# Altium schematic sheet SCB_PLLs.SchDoc: SCB_PLLs
size A3; Date: 18/06/2014; DrawnBy: J. Gabriel R.E.; Organization: Seven Solutions S.L.; Address1: C/Baza, Parcela 19, Nave 3; Address2: Polígono Ind. Juncaril; Address3: 18210-Peligros-Granada; Address4: Spain; Revision: 3.4; SheetNumber: 17; SheetTotal: 23; WebAddress: www.sevensols.com; Project: White Rabbit; ProjectName: Project Name
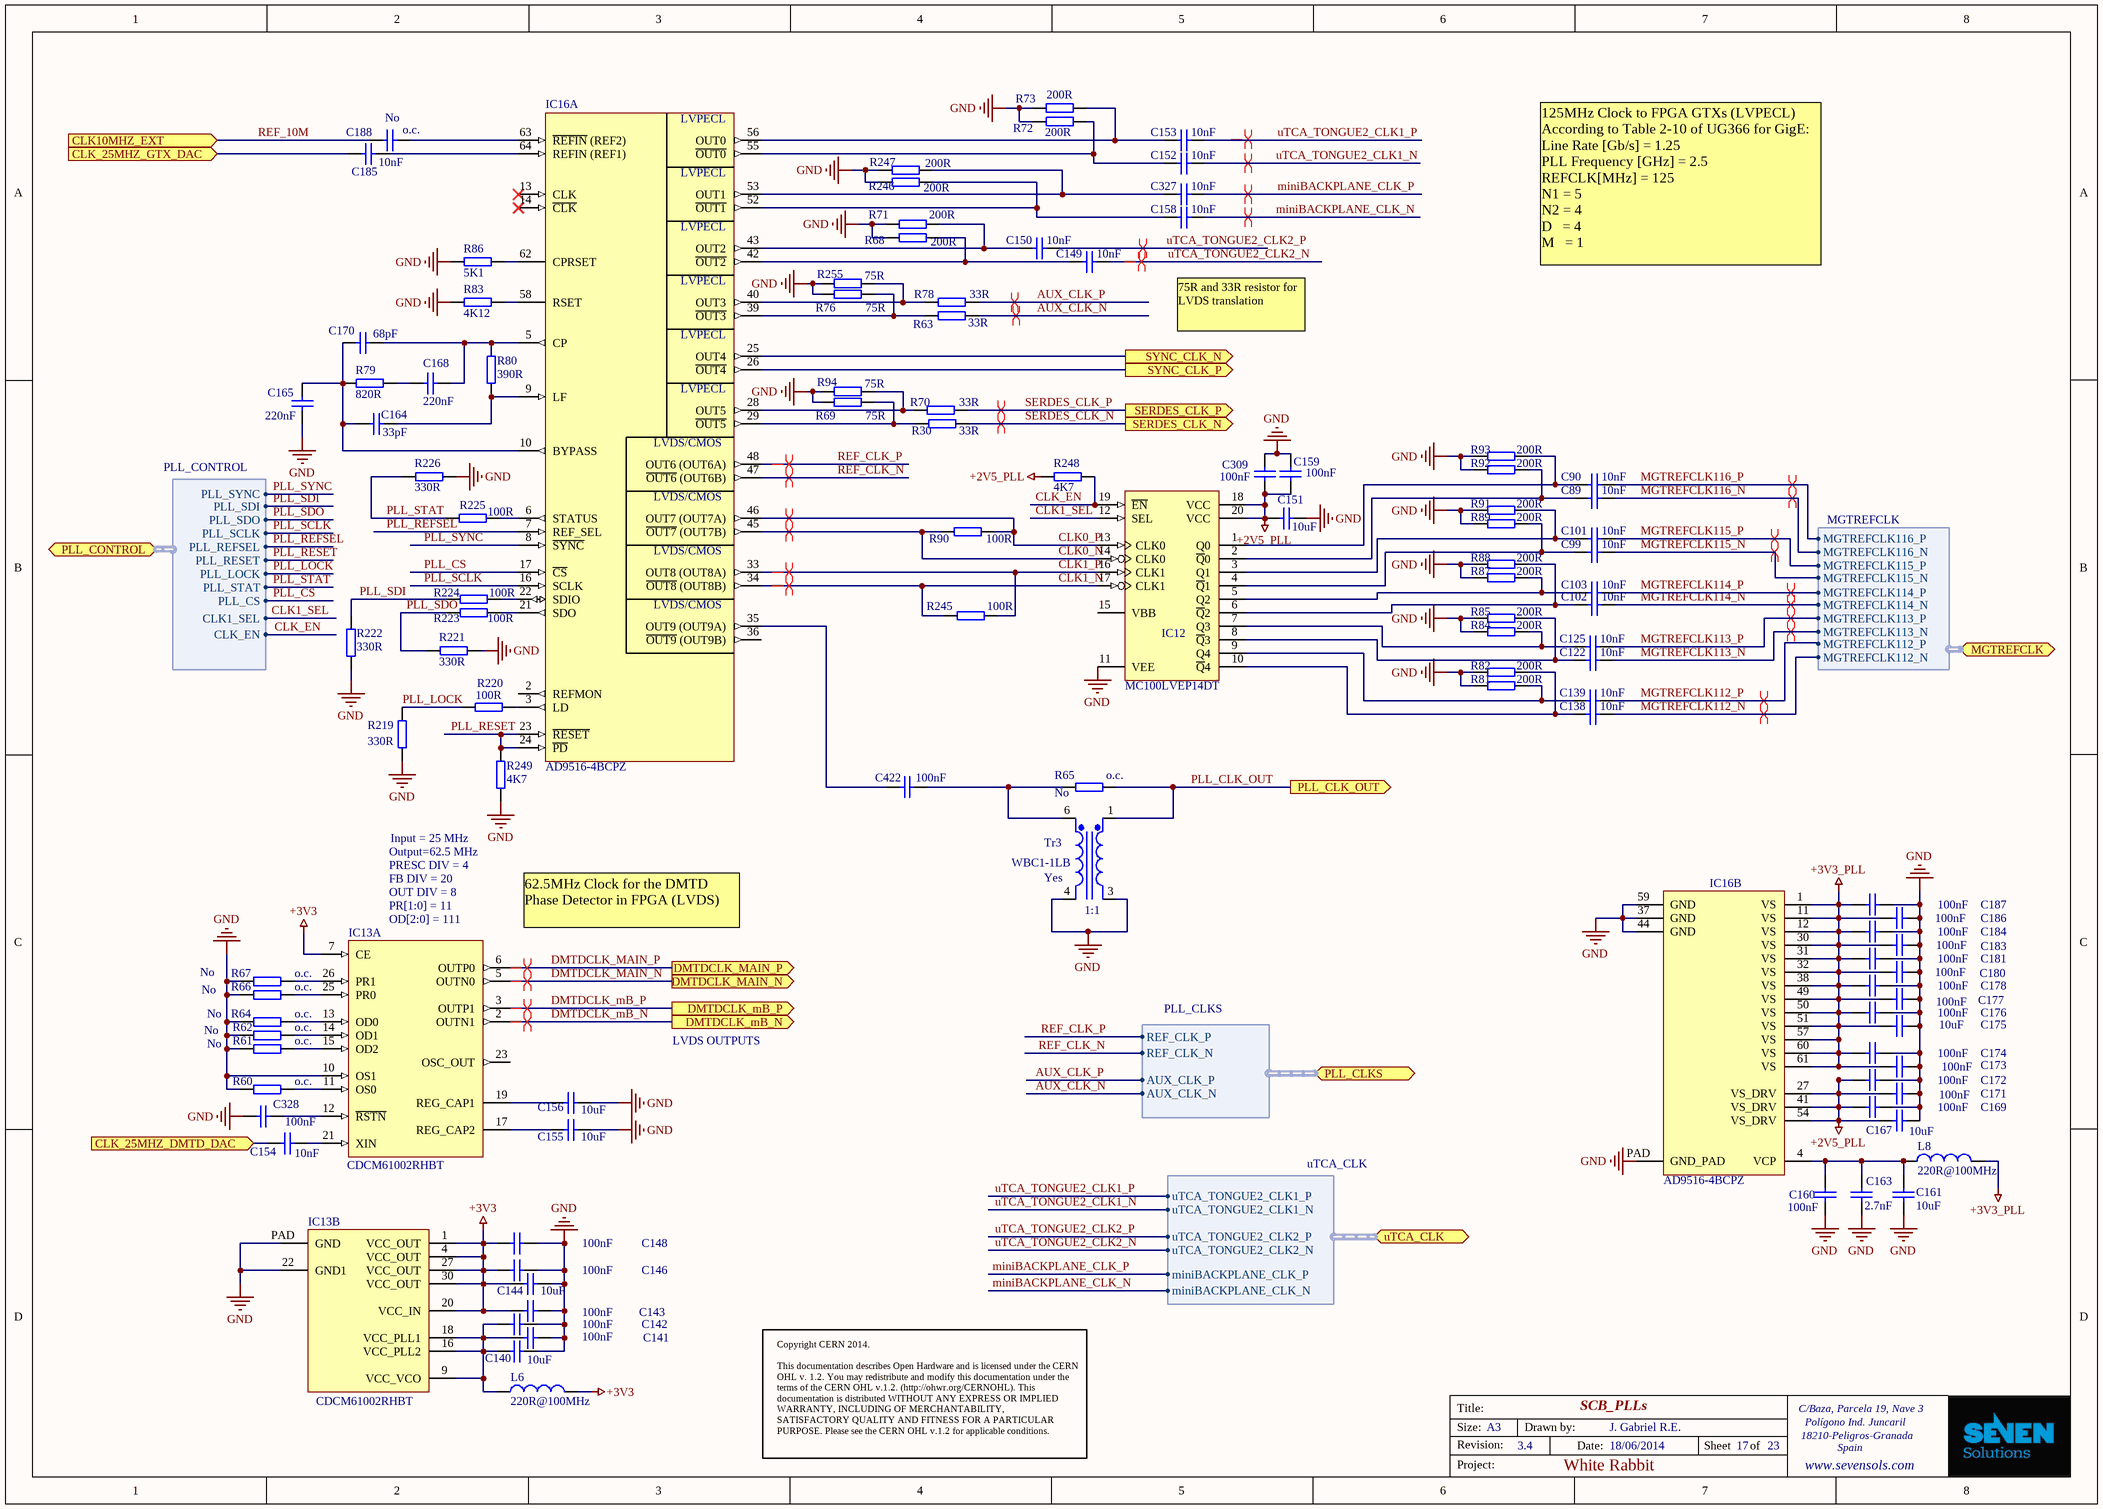
[diagram p0: SCB_PLLs.SchDoc]

## Parts
C89  10nF  [CC1005-0402]
C90  10nF  [CC1005-0402]
C99  10nF  [CC1005-0402]
C101  10nF  [CC1005-0402]
C102  10nF  [CC1005-0402]
C103  10nF  [CC1005-0402]
C122  10nF  [CC1005-0402]
C125  10nF  [CC1005-0402]
C138  10nF  [CC1005-0402]
C139  10nF  [CC1005-0402]
C140  10uF  [CC1608-0603]
C141  100nF  [CC1005-0402]
C142  100nF  [CC1005-0402]
C143  100nF  [CC1005-0402]
C144  10uF  [CC1608-0603]
C146  100nF  [CC1005-0402]
C148  100nF  [CC1005-0402]
C149  10nF  [CC1005-0402]
C150  10nF  [CC1005-0402]
C151  10uF  [CC1608-0603]
C152  10nF  [CC1005-0402]
C153  10nF  [CC1005-0402]
C154  10nF  [CC1005-0402]
C155  10uF  [CC1608-0603]
C156  10uF  [CC1608-0603]
C158  10nF  [CC1005-0402]
C159  100nF  [CC1005-0402]
C160  100nF  [CC1005-0402]
C161  10uF  [CC1608-0603]
C163  2.7nF  [CC1005-0402]
C164  33pF  [CC1608-0603]
C165  220nF  [CC1608-0603]
C167  10uF  [CC1608-0603]
C168  220nF  [CC1608-0603]
C169  100nF  [CC1005-0402]
C170  68pF  [CC1608-0603]
C171  100nF  [CC1005-0402]
C172  100nF  [CC1005-0402]
C173  100nF  [CC1005-0402]
C174  100nF  [CC1005-0402]
C175  10uF  [CC1608-0603]
C176  100nF  [CC1005-0402]
C177  100nF  [CC1005-0402]
C178  100nF  [CC1005-0402]
C180  100nF  [CC1005-0402]
C181  100nF  [CC1005-0402]
C183  100nF  [CC1005-0402]
C184  100nF  [CC1005-0402]
C185  10nF  [CC1005-0402]
C186  100nF  [CC1005-0402]
C187  100nF  [CC1005-0402]
C188  o.c.  Mounted: No  [CC1005-0402]
C309  100nF  [CC1005-0402]
C327  10nF  [CC1005-0402]
C328  100nF  [CC1005-0402]
C422  100nF  [CC1005-0402]
IC12  MC100LVEP14DT  [948E-02_N]
IC13  CDCM61002RHBT  [QFN32_POWERPAD]  (parts A,B of 2)
IC16  AD9516-4BCPZ  [QFN50P900X900X100-64M]  (parts A,B of 2)
L6  Impedance: 220R@100MHz  [0603]  (hidden comment: 220R@100MHz Ferrite Bead)
L8  Impedance: 220R@100MHz  [0603]  (hidden comment: 220R@100MHz Ferrite Bead)
R30  33R  [0402]
R60  o.c.  [0402]
R61  Mounted: No  [0402]  (hidden comment: o.c.)
R62  Mounted: No  [0402]  (hidden comment: o.c.)
R63  33R  [0402]
R64  Mounted: No  [0402]  (hidden comment: o.c.)
R65  Mounted: No  [0402]  (hidden comment: o.c.)
R66  Mounted: No  [0402]  (hidden comment: o.c.)
R67  Mounted: No  [0402]  (hidden comment: o.c.)
R68  200R  [0402]
R69  75R  [0402]
R70  33R  [0402]
R71  200R  [0402]
R72  200R  [0402]
R73  200R  [0402]
R76  75R  [0402]
R78  33R  [0402]
R79  820R  [0603]
R80  390R  [0603]
R81  200R  [0402]
R82  200R  [0402]
R83  4K12  [0402]
R84  200R  [0402]
R85  200R  [0402]
R86  5K1  [0402]
R87  200R  [0402]
R88  200R  [0402]
R89  200R  [0402]
R90  100R  [0402]
R91  200R  [0402]
R92  200R  [0402]
R93  200R  [0402]
R94  75R  [0402]
R219  330R  [0402]
R220  100R  [0402]
R221  330R  [0402]
R222  330R  [0402]
R223  100R  [0402]
R224  100R  [0402]
R225  100R  [0402]
R226  330R  [0402]
R245  100R  [0402]
R246  200R  [0402]
R247  200R  [0402]
R248  4K7  [0402]
R249  4K7  [0402]
R255  75R  [0402]
Tr3  WBC1-1LB  value 1:1  Mounted: Yes  [SMT6P150P]

## Ports
CLK10MHZ_EXT (in), CLK_25MHZ_DMTD_DAC (in), CLK_25MHZ_GTX_DAC (in), DMTDCLK_MAIN_N (out), DMTDCLK_MAIN_P (out), DMTDCLK_mB_N (out), DMTDCLK_mB_P (out), MGTREFCLK (harness MGTREFCLK), PLL_CLK_OUT (out), PLL_CLKS (harness PLL_CLKS), PLL_CONTROL (harness PLL_CONTROL), SERDES_CLK_N (out), SERDES_CLK_P (out), SYNC_CLK_N (out), SYNC_CLK_P (out), uTCA_CLK (harness uTCA_CLK)

## Harnesses
PLL_CONTROL: PLL_CS, PLL_STAT, PLL_LOCK, PLL_RESET, PLL_REFSEL, PLL_SCLK, PLL_SDO, PLL_SDI, PLL_SYNC, CLK1_SEL, CLK_EN
PLL_CLKS: REF_CLK_P, REF_CLK_N, AUX_CLK_P, AUX_CLK_N
MGTREFCLK: MGTREFCLK112_P, MGTREFCLK112_N, MGTREFCLK113_P, MGTREFCLK113_N, MGTREFCLK114_P, MGTREFCLK114_N, MGTREFCLK115_P, MGTREFCLK115_N, MGTREFCLK116_P, MGTREFCLK116_N
uTCA_CLK: uTCA_TONGUE2_CLK1_P, uTCA_TONGUE2_CLK1_N, uTCA_TONGUE2_CLK2_P, uTCA_TONGUE2_CLK2_N, miniBACKPLANE_CLK_P, miniBACKPLANE_CLK_N

## Nets
+2V5_PLL: C151.2 C159.2 C167.1 C169.2 C171.2 C172.2 C309.2 IC12.18(VCC) IC12.20(VCC) IC16.27(VS_DRV) IC16.41(VS_DRV) IC16.54(VS_DRV) R248.2
+3V3: C143.2 C144.1 C146.2 C148.2 IC13.1(VCC_OUT) IC13.4(VCC_OUT) IC13.7(CE) IC13.20(VCC_IN) IC13.27(VCC_OUT) IC13.30(VCC_OUT) L6.2
+3V3_PLL: C173.2 C174.2 C175.1 C176.2 C177.2 C178.2 C180.2 C181.2 C183.2 C184.2 C186.2 C187.2 IC16.1(VS) IC16.11(VS) IC16.12(VS) IC16.30(VS) IC16.31(VS) IC16.32(VS) IC16.38(VS) IC16.49(VS) IC16.50(VS) IC16.51(VS) IC16.57(VS) IC16.60(VS) IC16.61(VS) L8.2
GND: C140.2 C141.1 C142.1 C143.1 C144.2 C146.1 C148.1 C151.1 C155.2 C156.2 C159.1 C160.2 C161.1 C163.1 C165.1 C167.2 C169.1 C171.1 C172.1 C173.1 C174.1 C175.2 C176.1 C177.1 C178.1 C180.1 C181.1 C183.1 C184.1 C186.1 C187.1 C309.1 C328.2 IC12.11(VEE) IC13.10(OS1) IC13.22(GND1) IC13.PAD(GND) IC16.37(GND) IC16.44(GND) IC16.59(GND) IC16.PAD(GND_PAD) R60.2 R61.2 R62.2 R64.2 R66.2 R67.2 R68.2 R69.1 R71.2 R72.2 R73.2 R76.1 R81.2 R82.2 R83.1 R84.2 R85.2 R86.1 R87.2 R88.2 R89.2 R91.2 R92.2 R93.2 R94.1 R219.1 R221.1 R222.1 R226.1 R246.2 R247.2 R249.1 R255.1 Tr3.3(Sec-) Tr3.4(Pri-)
AUX_CLK_N: R63.2 ; port PLL_CLKS.AUX_CLK_N
AUX_CLK_P: R78.2 ; port PLL_CLKS.AUX_CLK_P
CLK0_N: IC12.14(CLK0) IC16.45(~{OUT7}_(OUT7B)) R90.1
CLK0_P: IC12.13(CLK0) IC16.46(OUT7_(OUT7A)) R90.2
CLK1_N: IC12.17(CLK1) IC16.34(~{OUT8}_(OUT8B)) R245.1
CLK1_P: IC12.16(CLK1) IC16.33(OUT8_(OUT8A)) R245.2
CLK1_SEL: IC12.12(SEL) ; port PLL_CONTROL.CLK1_SEL
CLK_25MHZ_DMTD_DAC: C154.2 ; port CLK_25MHZ_DMTD_DAC
CLK_25MHZ_GTX_DAC: C185.1 ; port CLK_25MHZ_GTX_DAC
CLK_EN: IC12.19(~{EN}) R248.1 ; port PLL_CONTROL.CLK_EN
DMTDCLK_MAIN_N: IC13.5(OUTN0) ; port DMTDCLK_MAIN_N
DMTDCLK_MAIN_P: IC13.6(OUTP0) ; port DMTDCLK_MAIN_P
DMTDCLK_mB_N: IC13.2(OUTN1) ; port DMTDCLK_mB_N
DMTDCLK_mB_P: IC13.3(OUTP1) ; port DMTDCLK_mB_P
MGTREFCLK112_N: C138.1 ; port MGTREFCLK.MGTREFCLK112_N
MGTREFCLK112_P: C139.1 ; port MGTREFCLK.MGTREFCLK112_P
MGTREFCLK113_N: C122.1 ; port MGTREFCLK.MGTREFCLK113_N
MGTREFCLK113_P: C125.1 ; port MGTREFCLK.MGTREFCLK113_P
MGTREFCLK114_N: C102.1 ; port MGTREFCLK.MGTREFCLK114_N
MGTREFCLK114_P: C103.1 ; port MGTREFCLK.MGTREFCLK114_P
MGTREFCLK115_N: C99.1 ; port MGTREFCLK.MGTREFCLK115_N
MGTREFCLK115_P: C101.1 ; port MGTREFCLK.MGTREFCLK115_P
MGTREFCLK116_N: C89.1 ; port MGTREFCLK.MGTREFCLK116_N
MGTREFCLK116_P: C90.1 ; port MGTREFCLK.MGTREFCLK116_P
miniBACKPLANE_CLK_N: C158.1 ; port uTCA_CLK.miniBACKPLANE_CLK_N
miniBACKPLANE_CLK_P: C327.1 ; port uTCA_CLK.miniBACKPLANE_CLK_P
PLL_CLK_OUT: R65.1 Tr3.1(Sec+) ; port PLL_CLK_OUT
PLL_CS: IC16.17(~{CS}) ; port PLL_CONTROL.PLL_CS
PLL_LOCK: R219.2 R220.2 ; port PLL_CONTROL.PLL_LOCK
PLL_REFSEL: IC16.7(REF_SEL) ; port PLL_CONTROL.PLL_REFSEL
PLL_RESET: IC16.23(~{RESET}) IC16.24(~{PD}) R249.2 ; port PLL_CONTROL.PLL_RESET
PLL_SCLK: IC16.16(SCLK) ; port PLL_CONTROL.PLL_SCLK
PLL_SDI: R222.2 R224.2 ; port PLL_CONTROL.PLL_SDI
PLL_SDO: R221.2 R223.2 ; port PLL_CONTROL.PLL_SDO
PLL_STAT: R225.2 R226.2 ; port PLL_CONTROL.PLL_STAT
PLL_SYNC: IC16.8(~{SYNC}) ; port PLL_CONTROL.PLL_SYNC
REF_10M: C188.1 ; port CLK10MHZ_EXT
REF_CLK_N: IC16.47(~{OUT6}_(OUT6B)) ; port PLL_CLKS.REF_CLK_N
REF_CLK_P: IC16.48(OUT6_(OUT6A)) ; port PLL_CLKS.REF_CLK_P
SERDES_CLK_N: R30.2 ; port SERDES_CLK_N
SERDES_CLK_P: R70.2 ; port SERDES_CLK_P
SYNC_CLK_N: IC16.25(OUT4) ; port SYNC_CLK_N
SYNC_CLK_P: IC16.26(~{OUT4}) ; port SYNC_CLK_P
uTCA_TONGUE2_CLK1_N: C152.1 ; port uTCA_CLK.uTCA_TONGUE2_CLK1_N
uTCA_TONGUE2_CLK1_P: C153.1 ; port uTCA_CLK.uTCA_TONGUE2_CLK1_P
uTCA_TONGUE2_CLK2_N: C149.1 ; port uTCA_CLK.uTCA_TONGUE2_CLK2_N
uTCA_TONGUE2_CLK2_P: C150.1 ; port uTCA_CLK.uTCA_TONGUE2_CLK2_P
NetC89_2: C89.2 IC12.2(~{Q}0) R92.1
NetC90_2: C90.2 IC12.1(Q0) R93.1
NetC99_2: C99.2 IC12.4(~{Q}1) R89.1
NetC101_2: C101.2 IC12.3(Q1) R91.1
NetC102_2: C102.2 IC12.6(~{Q}2) R88.1
NetC103_2: C103.2 IC12.5(Q2) R87.1
NetC122_2: C122.2 IC12.8(~{Q}3) R85.1
NetC125_2: C125.2 IC12.7(Q3) R84.1
NetC138_2: C138.2 IC12.10(~{Q}4) R82.1
NetC139_2: C139.2 IC12.9(Q4) R81.1
NetC140_1: C140.1 C141.2 C142.2 IC13.9(VCC_VCO) IC13.16(VCC_PLL2) IC13.18(VCC_PLL1) L6.1
NetC149_2: C149.2 IC16.42(~{OUT2}) R68.1
NetC150_2: C150.2 IC16.43(OUT2) R71.1
NetC152_2: C152.2 IC16.55(~{OUT0}) R72.1
NetC153_2: C153.2 IC16.56(OUT0) R73.1
NetC154_1: C154.1 IC13.21(XIN)
NetC155_1: C155.1 IC13.17(REG_CAP2)
NetC156_1: C156.1 IC13.19(REG_CAP1)
NetC158_2: C158.2 IC16.52(~{OUT1}) R246.1
NetC160_1: C160.1 C161.2 C163.2 IC16.4(VCP) L8.1
NetC164_1: C164.1 C165.2 C170.1 IC16.10(BYPASS) R79.1
NetC164_2: C164.2 IC16.9(LF) R80.1
NetC168_1: C168.1 R79.2
NetC168_2: C168.2 C170.2 IC16.5(CP) R80.2
NetC185_2: C185.2 IC16.64(REFIN_(REF1))
NetC188_2: C188.2 IC16.63(~{REFIN}_(REF2))
NetC327_2: C327.2 IC16.53(OUT1) R247.1
NetC328_1: C328.1 IC13.12(~{RSTN})
NetC422_1: C422.1 IC16.35(OUT9_(OUT9A))
NetC422_2: C422.2 R65.2 Tr3.6(Pri+)
NetIC13_11: IC13.11(OS0) R60.1
NetIC13_13: IC13.13(OD0) R64.1
NetIC13_14: IC13.14(OD1) R62.1
NetIC13_15: IC13.15(OD2) R61.1
NetIC13_25: IC13.25(PR0) R66.1
NetIC13_26: IC13.26(PR1) R67.1
NetIC16_3: IC16.3(LD) R220.1
NetIC16_6: IC16.6(STATUS) R225.1
NetIC16_21: IC16.21(SDO) R223.1
NetIC16_22: IC16.22(SDIO) R224.1
NetIC16_28: IC16.28(OUT5) R70.1 R94.2
NetIC16_29: IC16.29(~{OUT5}) R30.1 R69.2
NetIC16_39: IC16.39(~{OUT3}) R63.1 R76.2
NetIC16_40: IC16.40(OUT3) R78.1 R255.2
NetIC16_58: IC16.58(RSET) R83.2
NetIC16_62: IC16.62(CPRSET) R86.2

Not connected (* = marked no-connect by the designer): IC12 15(VBB); IC13 23(OSC_OUT); IC16 2(REFMON) 13(CLK)* 14(~{CLK})* 36(~{OUT9}_(OUT9B))

## Layout directives
differential pair: (no net found under the mark), AUX_CLK_N, AUX_CLK_P, CLK0_N, CLK0_P, CLK1_N, CLK1_P, DMTDCLK_MAIN_N, DMTDCLK_MAIN_P, DMTDCLK_mB_N, DMTDCLK_mB_P, MGTREFCLK112_N, MGTREFCLK112_P, MGTREFCLK113_N, MGTREFCLK113_P, MGTREFCLK114_N, MGTREFCLK114_P, MGTREFCLK115_N, MGTREFCLK115_P, MGTREFCLK116_N, MGTREFCLK116_P, miniBACKPLANE_CLK_N, miniBACKPLANE_CLK_P, REF_CLK_N, REF_CLK_P, SERDES_CLK_N, SERDES_CLK_P, uTCA_TONGUE2_CLK1_N, uTCA_TONGUE2_CLK2_N, uTCA_TONGUE2_CLK2_P

## Notes on the sheet
- 125MHz Clock to FPGA GTXs (LVPECL)
  According to Table 2-10 of UG366 for GigE:
  Line Rate [Gb/s] = 1.25
  PLL Frequency [GHz] = 2.5
  REFCLK[MHz] = 125
  N1 = 5
  N2 = 4
  D   = 4
  M   = 1
- 75R and 33R resistor for LVDS translation
- Output=62.5 MHz
- (near R249) Input = 25 MHz
- PRESC DIV = 4
- FB DIV = 20
- OUT DIV = 8
- (near IC13) PR[1:0] = 11
- (near IC13) OD[2:0] = 111
- (near IC13) 62.5MHz Clock for the DMTD Phase Detector in FPGA (LVDS)
- LVDS OUTPUTS
- Copyright CERN 2014.
  This documentation describes Open Hardware and is licensed under the CERN OHL v. 1.2. You may redistribute and modify this documentation under the terms of the CERN OHL v.1.2. (http://ohwr.org/CERNOHL). This documentation is distributed WITHOUT ANY EXPRESS OR IMPLIED WARRANTY, INCLUDING OF MERCHANTABILITY, SATISFACTORY QUALITY AND FITNESS FOR A PARTICULAR PURPOSE. Please see the CERN OHL v.1.2 for applicable conditions.
- Title:
- Size:
- Revision:
- A3
- Drawn by:
- Date:
- Sheet
- of
- Project:
- (in symbol AD9516, part A) LVPECL; LVDS/CMOS

## Library data of the parts
C89 C90 C99 C101-C103 C122 C125 C138 C139 C149 C150 C152-C154 C158 C185 C327 = CC0402_10NF_25V_10%_X7R: Capacitor; Manufacturer1: TDK; Manufacturer1 PN: C1005X7R1E103K; TC: X7R; Tolerance: ±10%; Voltage: 25V; Published: 8-Jun-2000; LatestRevisionDate: 17-Jul-2002; LatestRevisionNote: Re-released for DXP Platform.; PackageReference: RAD-0.3; Publisher: Altium Limited; Distributor1: Digikey; Distributor1 PN: 445-1260-1-ND; Case: 0402; Value: 10nF
C140 C144 C151 C155 C156 C161 C167 C175 = CC0603_10UF_6.3V_20%_X5R: Capacitor; Manufacturer1: TDK; Manufacturer1 PN: C1608X5R0J106M; TC: X5R; Tolerance: ±20%; Voltage: 6.3V; Published: 8-Jun-2000; LatestRevisionDate: 17-Jul-2002; LatestRevisionNote: Re-released for DXP Platform.; PackageReference: RAD-0.3; Publisher: Altium Limited; Distributor1: Digikey; Distributor1 PN: 445-4112-1-ND; Case: 0603; Value: 10uF
C141-C143 C146 C148 C159 C160 C169 C171-C174 C176-C178 C180 C181 C183 C184 C186 C187 C309 C328 C422 = CC0402_100NF_16V_10%_X7R: Capacitor; Manufacturer1: TDK; Manufacturer1 PN: C1005X7R1C104K; TC: X7R; Tolerance: ±10%; Voltage: 16V; Published: 8-Jun-2000; LatestRevisionDate: 17-Jul-2002; LatestRevisionNote: Re-released for DXP Platform.; PackageReference: RAD-0.3; Publisher: Altium Limited; Distributor1: Digikey; Distributor1 PN: 445-4952-1-ND; Case: 0402; Value: 100nF
C163 = CC0402_2.7NF_50V_10%_X7R: Capacitor; Manufacturer1: Panasonic; Manufacturer1 PN: ECJ-0EB1H272K; TC: X7R; Tolerance: ±10%; Voltage: 50V; Published: 8-Jun-2000; LatestRevisionDate: 17-Jul-2002; LatestRevisionNote: Re-released for DXP Platform.; PackageReference: RAD-0.3; Publisher: Altium Limited; Distributor1: Digikey; Distributor1 PN: PCC1726CT-ND; Case: 0402; Value: 2.7nF
C164 = CC0603_33PF_50V_5%_NP0: Capacitor; Manufacturer1: TDK; Manufacturer1 PN: C1608C0G1H330J; TC: COG; Tolerance: ±5%; Voltage: 50V; Published: 8-Jun-2000; LatestRevisionDate: 17-Jul-2002; LatestRevisionNote: Re-released for DXP Platform.; PackageReference: RAD-0.3; Publisher: Altium Limited; Distributor1: Digikey; Distributor1 PN: 445-1275-1-ND; Case: 0402; Value: 33pF
C165 C168 = CC0603_220NF_10V_10%_X7R: Capacitor; Manufacturer1: Yageo; Manufacturer1 PN: CC0603KRX7R6BB224; TC: X7R; Tolerance: ±10%; Voltage: 10V; Published: 8-Jun-2000; LatestRevisionDate: 17-Jul-2002; LatestRevisionNote: Re-released for DXP Platform.; PackageReference: RAD-0.3; Publisher: Altium Limited; Distributor1: Digikey; Distributor1 PN: 311-1346-1-ND; Case: 0402; Value: 220nF
C170 = CC0603_68PF_50V_5%_NP0: Capacitor; Manufacturer1: TDK Corporation; Manufacturer1 PN: C1608C0G1H680J; TC: COG; Tolerance: ±5%; Voltage: 50V; Published: 8-Jun-2000; LatestRevisionDate: 17-Jul-2002; LatestRevisionNote: Re-released for DXP Platform.; PackageReference: RAD-0.3; Publisher: Altium Limited; Distributor1: Digikey; Distributor1 PN: 445-1279-1-ND; Case: 0603; Value: 68pF
C188 = CC0402_10NF_25V_10%_X7R: Capacitor; Manufacturer1: TDK; Manufacturer1 PN: C1005X7R1E103K; TC: X7R; Tolerance: ±10%; Voltage: 25V; Value: 10nF; Published: 8-Jun-2000; LatestRevisionDate: 17-Jul-2002; LatestRevisionNote: Re-released for DXP Platform.; PackageReference: RAD-0.3; Publisher: Altium Limited; Distributor1: Digikey; Distributor1 PN: 445-1260-1-ND; Case: 0402
IC12 = MC100LVEP14DT: Low-Voltage 1:5 Differential LVECL/LVPECL/LVEPECL/HSTL Clock Driver; Published: 15-Apr-2002; LatestRevisionDate: 12-Dec-2006; LatestRevisionNote: IPC-7351 Footprint Added.; DatasheetVersion: Jan-2000; PackageVersion: Mar-2000; PackageReference: 948E-02; Publisher: Altium Limited; PackageDescription: 20-Pin Thin Small Outline Package 0.65 mm Pitch; ComponentLink1Description: Manufacturer Link; ComponentLink1URL: http://www.onsemi.com/; ComponentLink2Description: Datasheet; ComponentLink2URL: http://www.onsemi.com/pub/Collateral/MC100LVEP14-D.PDF
IC13 = CDCM61002: Low Jitter Clock Generator, Two Outpust, Integrated VCO; Manufacturer: Texas Instruments; Value: CDCM61002RHBT; Distributor1: Digikey; Distributor1 PN: 296-24193-1-ND
IC16 = AD9516: PLL with clock fanout; Value: AD9516-4BCPZ; Distributor1 PN: AD9516-4BCPZ-ND; Distributor1: Digikey
L6 L8 = L_FERRITE_BEAD: ferrite bead; Manufacturer1: Murata; Manufacturer1 PN: BLM18KG221SN1D; Current Rating: 2.2A; DCR: 50mOhm; Case: 0603; Distributor1: Digikey; Distributor1 PN: 490-5255-1-ND
R30 R63 R70 R78 = R0402_33R_±1%_0.1W_100PPM: SMD Resistor; Manufacturer1: Panasonic; Manufacturer1 PN: ERJ-2RKF33R0X; TCR: 100ppm; Power Rating: 0.1W; Tolerance: ±1%; Case: 0402; Distributor1: DigiKey; Distributor1 PN: P33.0LTR-ND; Value: 33R
R60-R62 R64-R67 = R0402_O.C.: SMD Resistor; Case: 0402; Manufacturer1: N/A; Manufacturer1 PN: N/A; Distributor1: N/A; Distributor1 PN: N/A; TCR: N/A; Power Rating: N/A; Tolerance: N/A; Value: o.c.
R68 R71-R73 R81 R82 R84 R85 R87-R89 R91-R93 R246 R247 = R0402_200R_±1%_0.1W_100PPM: SMD Resistor; Manufacturer1: Panasonic; Manufacturer1 PN: ERJ-2RKF2000X; TCR: 100ppm; Power Rating: 0.1W; Tolerance: ±1%; Case: 0402; Distributor1: DigiKey; Distributor1 PN: P200LCT-ND; Value: 200R
R69 R76 R94 R255 = R0402_75R_±1%_0.1W_100PPM: SMD Resistor; Manufacturer1: Panasonic; Manufacturer1 PN: ERJ-2RKF75R0X; TCR: 100ppm; Power Rating: 0.1W; Tolerance: ±1%; Case: 0402; Distributor1: DigiKey; Distributor1 PN: P75.0LCT-ND; Value: 75R
R79 = R0603_820R_±1%_0.1W_100PPM: SMD Resistor; Manufacturer1: Panasonic; Manufacturer1 PN: ERJ-3EKF8200V; TCR: 100ppm; Power Rating: 0.1W; Tolerance: ±1%; Case: 0603; Distributor1: DigiKey; Distributor1 PN: P820HCT-ND; Value: 820R
R80 = R0603_390R_±1%_0.1W_100PPM: SMD Resistor; Manufacturer1: Panasonic; Manufacturer1 PN: ERJ-3EKF3900V; TCR: 100ppm; Power Rating: 0.1W; Tolerance: ±1%; Case: 0603; Distributor1: DigiKey; Distributor1 PN: P390HCT-ND; Value: 390R
R83 = R0402_4K12_±1%_0.1W_100PPM: SMD Resistor; Manufacturer1: Panasonic; Manufacturer1 PN: ERJ-2RKF4121X; TCR: 100ppm; Power Rating: 0.1W; Tolerance: ±1%; Case: 0402; Distributor1: DigiKey; Distributor1 PN: P4.12KLCT-ND; Value: 4K12
R86 = R0402_5K1_±1%_0.1W_100PPM: SMD Resistor; Manufacturer1: Panasonic; Manufacturer1 PN: ERJ-2RKF5101X; TCR: 100ppm; Power Rating: 0.1W; Tolerance: ±1%; Case: 0402; Distributor1: DigiKey; Distributor1 PN: P5.10KLCT-ND; Value: 5K1
R90 R220 R223-R225 R245 = R0402_100R_±1%_0.1W_100PPM: SMD Resistor; Manufacturer1: Panasonic; Manufacturer1 PN: ERJ-2RKF1000X; TCR: 100ppm; Power Rating: 0.1W; Tolerance: ±1%; Case: 0402; Distributor1: DigiKey; Distributor1 PN: P100LCT-ND; Value: 100R
R219 R221 R222 R226 = R0402_330R_±1%_0.1W_100PPM: SMD Resistor; Manufacturer1: Panasonic; Manufacturer1 PN: ERJ-2RKF3300X; TCR: 100ppm; Power Rating: 0.1W; Tolerance: ±1%; Case: 0402; Distributor1: DigiKey; Distributor1 PN: P330LCT-ND; Value: 330R
R248 R249 = R0402_4.7K_±1%_0.1W_100PPM: SMD Resistor; Manufacturer1: Panasonic; Manufacturer1 PN: ERJ-2RKF4701X; TCR: 100ppm; Power Rating: 0.1W; Tolerance: ±1%; Case: 0402; Distributor1: DigiKey; Distributor1 PN: ERJ-2RKF4701X; Value: 4K7
Tr3 = WBC1-1LB: SMT Mini WideBand Transformer 1:1, 10uH,; Manufacturer: Coilcraft; Published: 8-Jun-2000; LatestRevisionDate: 17-Jul-2002; LatestRevisionNote: Re-released for DXP Platform.; PackageReference: TRF_4; Publisher: Altium Limited; Manufacturer PN: WBC1-1LB